# EAGLE schematic DUINOMITE-MEGA_Rev_C (EAGLE 4.16)
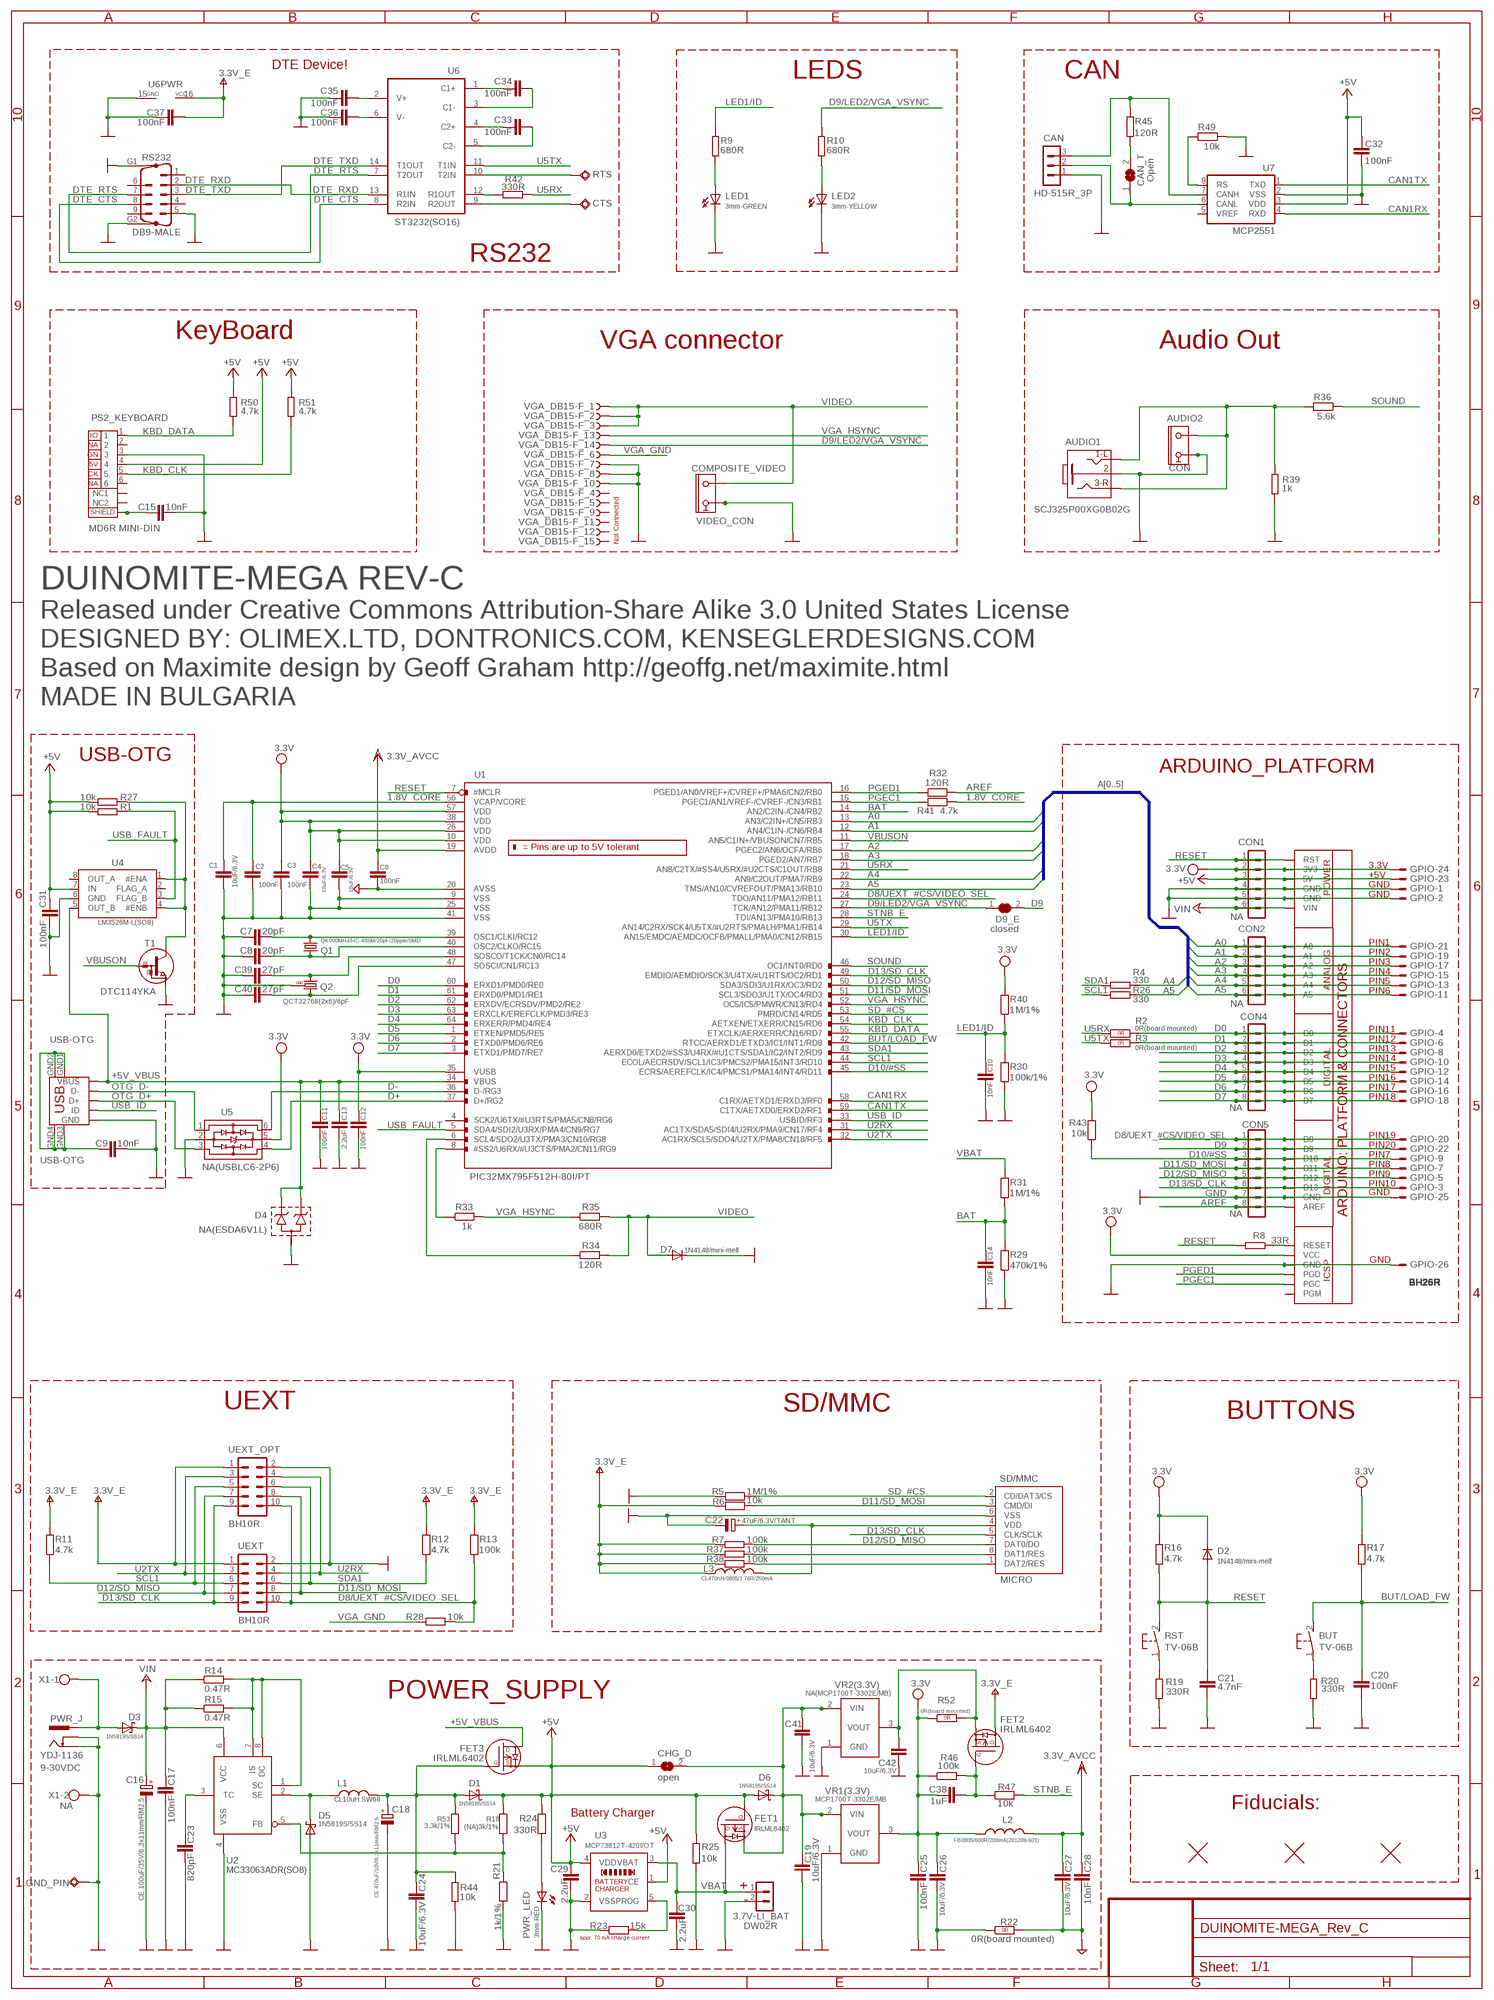
[diagram p0: schematic, sheet 1]

## Parts
3.7V-LI_BAT  DW02R  CON2DW02R  [DW02R]
AUDIO1  SCJ325P00XG0B02G  JACK-3PIN1  [AUDIO_JACK_3.5MM_DECREASED_PAD]
AUDIO2  CON  VIDEO_CINCH  [VIDEO_CINCH]
BUT  TV-06B  31-XX  [B3F-31XX]
C1  10uF/6.3V  C-EUC0805_5MIL_DWS  [C0805_5MIL_DWS]
C2  100nF  C-EUC0603_DWS  [C0603_DWS]
C3  100nF  C-EUC0603_DWS  [C0603_DWS]
C4  10uF/6.3V  C-EUC0603_DWS  [C0603_DWS]
C5  10uF/6.3V  C-EUC0603_DWS  [C0603_DWS]
C6  100nF  C-EUC0603_DWS  [C0603_DWS]
C7  20pF  C-EUC0603_DWS  [C0603_DWS]
C8  20pF  C-EUC0603_DWS  [C0603_DWS]
C9  10nF  C-EUC0603_DWS  [C0603_DWS]
C10  10nF  C-EUC0603_DWS  [C0603_DWS]
C11  100nF  C-EUC0603_DWS  [C0603_DWS]
C12  100nF  C-EUC0603_DWS  [C0603_DWS]
C13  2.2uF  C-EUC0603_DWS  [C0603_DWS]
C14  10nF  C-EUC0603_DWS  [C0603_DWS]
C15  10nF  C-EUC0603_DWS  [C0603_DWS]
C16  CE 100uF/35V/6.3x11mm/RM2.5  CPOL-EUE2.5-6.3  [E2,5-6,3]
C17  100nF  C-EUC0603_DWS  [C0603_DWS]
C18  CE 470uF/10V/6.3x11mm/RM2.5  CPOL-EUE2.5-6.3  [E2,5-6,3]
C19  10uF/6.3V  C-EUC0603_DWS  [C0603_DWS]
C20  100nF  C-EUC0603_DWS  [C0603_DWS]
C21  4.7nF  C-EUC0603_DWS  [C0603_DWS]
C22  47uF/6.3V/TANT  CPOL-EUCT3528  [CT3528]
C23  820pF  C-EUC0603_DWS  [C0603_DWS]
C24  10uF/6.3V  C-EUC0805_5MIL_DWS  [C0805_5MIL_DWS]
C25  100nF  C-EUC0603_DWS  [C0603_DWS]
C26  10uF/6.3V  C-EUC0805_5MIL_DWS  [C0805_5MIL_DWS]
C27  10uF/6.3V  C-EUC0805_5MIL_DWS  [C0805_5MIL_DWS]
C28  10nF  C-EUC0603_DWS  [C0603_DWS]
C29  2.2uF  C-EUC0603_DWS  [C0603_DWS]
C30  2.2uF  C-EUC0603_DWS  [C0603_DWS]
C31  100nF  C-EUC0603_DWS  [C0603_DWS]
C32  100nF  C-EUC0603_DWS  [C0603_DWS]
C33  100nF  C-EUC0603_DWS  [C0603_DWS]
C34  100nF  C-EUC0603_DWS  [C0603_DWS]
C35  100nF  C-EUC0603_DWS  [C0603_DWS]
C36  100nF  C-EUC0603_DWS  [C0603_DWS]
C37  100nF  C-EUC0603_DWS  [C0603_DWS]
C38  1uF  C-EUC0603_DWS  [C0603_DWS]
C39  27pF  C-EUC0603_DWS  [C0603_DWS]
C40  27pF  C-EUC0603_DWS  [C0603_DWS]
C41  10uF/6.3V  C-EUC0603_DWS_NA  [C0603_DWS_NA]
C42  10uF/6.3V  C-EUC0603_DWS_NA  [C0603_DWS_NA]
CAN  HD-515R_3P  CON3HD-515R_3P  [HD-515R_3P]
CAN_T  Open  SJ  [SJ]
CHG_D  open  SJ  [SJ]
COMPOSITE_VIDEO  VIDEO_CON  VIDEO_CINCH  [VIDEO_CINCH]
CON1  NA  CON6PN1X6  [PN1X6]
CON2  NA  CON6PN1X6  [PN1X6]
CON4  NA  CON8PN1X8  [PN1X8]
CON5  NA  CON8PN1X8  [PN1X8]
CTS  TESTPAD3  [TEST_PAD40/70/SQUARE]
D1  1N5819S/SS14  SCHOTKKY7.62SS2  [MLL-41]
D2  1N4148/mini-melf  DSMD  [MINI-MELF]
D3  1N5819S/SS14  SCHOTKKY7.62SS2  [MLL-41]
D4  NA(ESDA6V1L)  MMBZ5V6ALT1  [SOT-23]
D5  1N5819S/SS14  SCHOTKKY7.62SS2  [MLL-41]
D6  1N5819S/SS14  SCHOTKKY7.62SS2  [MLL-41]
D7  1N4148/mini-melf  DSMD  [MINI-MELF]
D9_E  closed  SJSJ-CLOSE  [SJ-CLOSE]
FET1  IRLML6402  P-MOS+DIODIRLML6402  [SOT23]
FET2  IRLML6402  P-MOS+DIODIRLML6402  [SOT23]
FET3  IRLML6402  P-MOS+DIODIRLML6402  [SOT23]
FID1  FIDUCIAL1X2  [FIDUCIAL-1X2]
FID2  FIDUCIAL1X2  [FIDUCIAL-1X2]
FID3  FIDUCIAL1X2  [FIDUCIAL-1X2]
GND_PIN  TESTPAD3  [TEST_PAD40/70/SQUARE]
GPIO  BH26R  ML26RE  [BH26R]
L1  CL10uH SW68  LSW68  [SW68]
L2  FB0805/600R/200mA(201209-601)  L-USL0805_5MIL_DWS  [L0805_5MIL_DWS]
L3  CL470nH/0805/1.76R/250mA  L-USL0805_5MIL_DWS  [L0805_5MIL_DWS]
LED1  3mm-GREEN  LED3.0MM  [LED-3.0MM]
LED2  3mm-YELLOW  LED3.0MM  [LED-3.0MM]
PS2_KEYBOARD  MD6R MINI-DIN  PS2PS2  [PS2]
PWR_J  YDJ-1136  PWR-JAKPWR_JACK_UNI_MILLING  [PWR_JACK_UNI_MILLING]
PWR_LED  3mm-RED  LED3.0MM  [LED-3.0MM]
Q1  Q8.000MHz/HC-49SM/20pF/20ppm/SMD  HC49/S1  [HC49/SMD2_THIN]
Q2  QCT32768(2x6)/6pF  Q_GND1  [TC26H_3_REPAIR_SMD]
R1  10k  R-EU_R0603_5MIL_DWS  [R0603_5MIL_DWS]
R2  0R(board mounted)  R_0R0R(NA)  [0603_0R]
R3  0R(board mounted)  R_0R0R(NA)  [0603_0R]
R4  330  R-EU_R0603_5MIL_DWS  [R0603_5MIL_DWS]
R5  1M/1%  R-EU_R0603_5MIL_DWS  [R0603_5MIL_DWS]
R6  10k  R-EU_R0603_5MIL_DWS  [R0603_5MIL_DWS]
R7  100k  R-EU_R0603_5MIL_DWS  [R0603_5MIL_DWS]
R8  33R  R-EU_R0603_5MIL_DWS  [R0603_5MIL_DWS]
R9  680R  R-EU_R0603_5MIL_DWS  [R0603_5MIL_DWS]
R10  680R  R-EU_R0603_5MIL_DWS  [R0603_5MIL_DWS]
R11  4.7k  R-EU_R0603_5MIL_DWS  [R0603_5MIL_DWS]
R12  4.7k  R-EU_R0603_5MIL_DWS  [R0603_5MIL_DWS]
R13  100k  R-EU_R0603_5MIL_DWS  [R0603_5MIL_DWS]
R14  0.47R  R-EU_R1206_5MIL_WS  [R1206_5MIL_WS]
R15  0.47R  R-EU_R1206_5MIL_WS  [R1206_5MIL_WS]
R16  4.7k  R-EU_R0603_5MIL_DWS  [R0603_5MIL_DWS]
R17  4.7k  R-EU_R0603_5MIL_DWS  [R0603_5MIL_DWS]
R18  (NA)3k/1%  R-EU_R0603_5MIL_DWS  [R0603_5MIL_DWS]
R19  330R  R-EU_R0603_5MIL_DWS  [R0603_5MIL_DWS]
R20  330R  R-EU_R0603_5MIL_DWS  [R0603_5MIL_DWS]
R21  1k/1%  R-EU_R0603_5MIL_DWS  [R0603_5MIL_DWS]
R22  0R(board mounted)  R_0R0R(NA)  [0603_0R]
R23  15k  R-EU_R0603_5MIL_DWS  [R0603_5MIL_DWS]
R24  330R  R-EU_R0603_5MIL_DWS  [R0603_5MIL_DWS]
R25  10k  R-EU_R0603_5MIL_DWS  [R0603_5MIL_DWS]
R26  330  R-EU_R0603_5MIL_DWS  [R0603_5MIL_DWS]
R27  10k  R-EU_R0603_5MIL_DWS  [R0603_5MIL_DWS]
R28  10k  R-EU_R0603_5MIL_DWS  [R0603_5MIL_DWS]
R29  470k/1%  R-EU_R0603_5MIL_DWS  [R0603_5MIL_DWS]
R30  100k/1%  R-EU_R0603_5MIL_DWS  [R0603_5MIL_DWS]
R31  1M/1%  R-EU_R0603_5MIL_DWS  [R0603_5MIL_DWS]
R32  120R  R-EU_R0603_5MIL_DWS  [R0603_5MIL_DWS]
R33  1k  R-EU_R0603_5MIL_DWS  [R0603_5MIL_DWS]
R34  120R  R-EU_R0603_5MIL_DWS  [R0603_5MIL_DWS]
R35  680R  R-EU_R0603_5MIL_DWS  [R0603_5MIL_DWS]
R36  5.6k  R-EU_R0603_5MIL_DWS  [R0603_5MIL_DWS]
R37  100k  R-EU_R0603_5MIL_DWS  [R0603_5MIL_DWS]
R38  100k  R-EU_R0603_5MIL_DWS  [R0603_5MIL_DWS]
R39  1k  R-EU_R0603_5MIL_DWS  [R0603_5MIL_DWS]
R40  1M/1%  R-EU_R0603_5MIL_DWS  [R0603_5MIL_DWS]
R41  4.7k  R-EU_R0603_5MIL_DWS  [R0603_5MIL_DWS]
R42  330R  R-EU_R0603_5MIL_DWS  [R0603_5MIL_DWS]
R43  10k  R-EU_R0603_5MIL_DWS  [R0603_5MIL_DWS]
R44  10k  R-EU_R0603_5MIL_DWS  [R0603_5MIL_DWS]
R45  120R  R-EU_R1206_5MIL_WS  [R1206_5MIL_WS]
R46  100k  R-EU_R0603_5MIL_DWS  [R0603_5MIL_DWS]
R47  10k  R-EU_R0603_5MIL_DWS  [R0603_5MIL_DWS]
R49  10k  R-EU_R0603_5MIL_DWS  [R0603_5MIL_DWS]
R50  4.7k  R-EU_R0603_5MIL_DWS  [R0603_5MIL_DWS]
R51  4.7k  R-EU_R0603_5MIL_DWS  [R0603_5MIL_DWS]
R52  0R(board mounted)  R_0R0R(NA)  [0603_0R]
R53  3.3k/1%  R-EU_R0603_5MIL_DWS  [R0603_5MIL_DWS]
RS232  DB9-MALE  M09HP_DB9-BMR  [DB9-BMR]
RST  TV-06B  31-XX  [B3F-31XX]
RTS  TESTPAD3  [TEST_PAD40/70/SQUARE]
SD/MMC  MICRO  MICRO_SD/MMC  [TFR-MEM-CON]
T1  DTC114YKA  DIGITAL_TRANSISTORS-NPNDTC114YKA  [SOT-23]
U1  PIC32MX795F512H-80I/PT  PIC32MX795F512HT-80I/PT  [LPTQFP64]
U2  MC33063ADR(SO8)  MC34063A_OFF  [SO-8_TRM]
U3  MCP73812T-420I/OT  MCP7381XSOT-23-5  [SOT-23-5]
U4  LM3526M-L(SO8)  LM3526-L  [SO-8]
U5  NA(USBLC6-2P6)  USBLC6-2  [USBLC6-2P6]
U6  ST3232(SO16)  MAX32321  [SO16-150MIL-THIN_PADS]
U7  MCP2551  [SO-08]
U$1  3x(PN1x8)+1x(PN1x6)+WU06S  PIC_PLATFORM3  [PIC_PLATFORM_MAXMITE_WITHOUT_DIMENSIO_LAYER]
UEXT  BH10R  ML10R  [BH10R]
UEXT_OPT  BH10R  ML10R  [BH10R]
USB-OTG  USB-OTG  MINI_USB9  [USB_MINI_9PIN]
VGA_DB15-F  DB1522  [DB15-F_22MM]
VR1(3.3V)  MCP1700T-3302E/MB  MCP1700-REP1  [SOT89_REP_THERMALOFF]
VR2(3.3V)  NA(MCP1700T-3302E/MB)  MCP1700-REP1  [SOT89_REP_THERMALOFF]
X1  NA  W237-102  [W237-102]

## Nets
1.8V_CORE: C1.1 C2.1 R41.1 U1.56(VCAP/VCORE)
+5V: C29.1 C31.1 C32.1 CHG_D.1 CON1.3 D1.K(C) D6.A FET1.1(G) FET3.2(S) GPIO.23 PS2_KEYBOARD.4 R1.2 R18.1 R24.1 R25.1 R27.2 R50.1 R51.1 U3.1(CE) U3.4(VDD) U4.7(IN) U7.3(VDD) U$1.5V
+5V_VBUS [pwr]: C11.2 C13.1 D4.1 D4.2 FET3.3(D) U1.34(VBUS) U4.5(OUT_B) USB-OTG.VBUS
+24V: C16.+ C17.1 CON1.6 D3.K(C) R14.1 R15.1 U2.6(VCC) U$1.VIN ; supply symbol labelled VIN
A0: CON2.1 GPIO.21 U1.13(AN3/C2IN+/CN5/RB3) U$1.A0
A1: CON2.2 GPIO.19 U1.12(AN4/C1IN-/CN6/RB4) U$1.A1
A2: CON2.3 GPIO.17 U1.17(PGEC2/AN6/OCFA/RB6) U$1.A2
A3: CON2.4 GPIO.15 U1.18(PGED2/AN7/RB7) U$1.A3
A4: CON2.5 GPIO.13 R4.1 U1.22(AN9/C2OUT/PMA7/RB9) U$1.A4
A5: CON2.6 GPIO.11 R26.1 U1.23(TMS/AN10/CVREFOUT/PMA13/RB10) U$1.A5
AGND: C6.2 C27.2 C28.2 R22.2(1.2) U1.20(AVSS)
AREF: CON5.8 R32.1 U$1.AREF
BAT: C14.2 R29.2 R31.1 U1.14(AN2/C2IN-/CN4/RB2)
BUT/LOAD_FW: BUT.2(S) C20.1 R17.2 U1.42(RTCC/AERXD1/ETXD3/IC1/INT1/RD8)
CAN1RX: U1.58(C1RX/AETXD1/ERXD3/RF0) U7.4(RXD)
CAN1TX: U1.59(C1TX/AETXD0/ERXD2/RF1) U7.1(TXD)
CANH: CAN.3 R45.2 U7.7(CANH)
CANL: CAN.2 CAN_T.1 U7.6(CANL)
D0: CON4.1 GPIO.4 R2.2(1.2) U1.60(ERXD1/PMD0/RE0) U$1.D0
D1: CON4.2 GPIO.6 R3.2(1.2) U1.61(ERXD0/PMD1/RE1) U$1.D1
D2: CON4.3 GPIO.8 U1.62(ERXDV/ECRSDV/PMD2/RE2) U$1.D2
D3: CON4.4 GPIO.10 U1.63(ERXCLK/EREFCLK/PMD3/RE3) U$1.D3
D4: CON4.5 GPIO.12 U1.64(ERXERR/PMD4/RE4) U$1.D4
D5: CON4.6 GPIO.14 U1.1(ETXEN/PMD5/RE5) U$1.D5
D6: CON4.7 GPIO.16 U1.2(ETXD0/PMD6/RE6) U$1.D6
D7: CON4.8 GPIO.18 U1.3(ETXD1/PMD7/RE7) U$1.D7
D8/UEXT_#CS/VIDEO_SEL: CON5.1 GPIO.20 R13.1 R28.2 U1.24(TDO/AN11/PMA12/RB11) U$1.D8 UEXT.10 UEXT_OPT.10
D9: CON5.2 D9_E.2 GPIO.22 U$1.D9
D9/LED2/VGA_VSYNC: D9_E.1 R10.2 U1.27(TCK/AN12/PMA11/RB12) VGA_DB15-F.14
D10/#SS: CON5.3 GPIO.9 R43.1 U1.45(ECRS/AEREFCLK/IC4/PMCS1/PMA14/INT4/RD11) U$1.D10
D11/SD_MOSI: CON5.4 GPIO.7 R6.1 SD/MMC.3(CMD/DI) U1.51(SCL3/SDO3/U1TX/OC4/RD3) U$1.D11 UEXT.8 UEXT_OPT.8
D12/SD_MISO: CON5.5 GPIO.5 R7.1 SD/MMC.7(DAT0/DO) U1.50(SDA3/SDI3/U1RX/OC3/RD2) U$1.D12 UEXT.7 UEXT_OPT.7
D13/SD_CLK: CON5.6 GPIO.3 SD/MMC.5(CLK/SCLK) U1.49(EMDIO/AEMDIO/SCK3/U4TX/#U1RTS/OC2/RD1) U$1.D13 UEXT.9 UEXT_OPT.9
D+: U1.37(D+/RG2) U5.4
D-: U1.36(D-/RG3) U5.6
DTE_CTS: RS232.8 U6.8(R2IN)
DTE_RTS: RS232.7 U6.7(T2OUT)
DTE_RXD: RS232.2 U6.13(R1IN)
DTE_TXD: RS232.3 U6.14(T1OUT)
GND [pwr]: 3.7V-LI_BAT.2 AUDIO1.1 AUDIO2.GND1(GND) AUDIO2.GND1A(GND) AUDIO2.GND1B(GND) AUDIO2.GND1C(GND) AUDIO2.GND1D(GND) AUDIO2.GND1E(GND) AUDIO2.GND2(GND) AUDIO2.GND3(GND) AUDIO2.GND3C(GND) AUDIO2.GND3D(GND) AUDIO2.GND3E(GND) AUDIO2.GNG3A(GND) AUDIO2.GNG3B(GND) C1.2 C2.2 C3.2 C4.2 C5.2 C7.1 C8.1 C9.1 C10.1 C11.1 C12.1 C13.2 C14.1 C15.2 C16.- C17.2 C18.- C19.2 C20.2 C21.2 C22.- C23.2 C24.2 C25.2 C26.2 C29.2 C30.2 C31.2 C32.2 C35.2 C36.2 C37.2 C39.1 C40.1 C41.2 C42.2 CAN.1 COMPOSITE_VIDEO.GND1(GND) COMPOSITE_VIDEO.GND1A(GND) COMPOSITE_VIDEO.GND1B(GND) COMPOSITE_VIDEO.GND1C(GND) COMPOSITE_VIDEO.GND1D(GND) COMPOSITE_VIDEO.GND1E(GND) COMPOSITE_VIDEO.GND2(GND) COMPOSITE_VIDEO.GND3(GND) COMPOSITE_VIDEO.GND3C(GND) COMPOSITE_VIDEO.GND3D(GND) COMPOSITE_VIDEO.GND3E(GND) COMPOSITE_VIDEO.GNG3A(GND) COMPOSITE_VIDEO.GNG3B(GND) CON1.4 CON1.5 CON5.7 D4.3 D5.A D7.C(K) GND_PIN.P$1(PP) GPIO.1 GPIO.2 GPIO.25 GPIO.26 LED1.K(C) LED2.K(C) PS2_KEYBOARD.3 PWR_J.- PWR_J.-- PWR_LED.K(C) Q2.GND R5.2 R19.1 R20.1 R21.2 R22.1(1.1) R23.1 R25.2 R29.1 R30.1 R39.2 R44.2 R49.1 RS232.5 RS232.G1 RS232.G2 SD/MMC.6(VSS) T1.2(E) U1.9(VSS) U1.25(VSS) U1.41(VSS) U2.4(VSS) U3.2(VSS) U4.6(GND) U5.2 U6.15(GND) U7.2(VSS) U$1.GND U$1.GND@1(GND) U$1.GND@2(GND) U$1.GND@3(GND) UEXT.2 UEXT_OPT.2 USB-OTG.GND VGA_DB15-F.7 VGA_DB15-F.8 VGA_DB15-F.10 VR1(3.3V).1(GND) VR2(3.3V).1(GND) X1.2
KBD_CLK: PS2_KEYBOARD.5 R51.2 U1.54(AETXEN/ETXERR/CN15/RD6)
KBD_DATA: PS2_KEYBOARD.1 R50.2 U1.55(ETXCLK/AERXERR/CN16/RD7)
LED1/ID: C10.2 R9.2 R30.2 R40.1 U1.30(AN15/EMDC/AEMDC/OCFB/PMALL/PMA0/CN12/RB15)
MCIDAT1: R37.1 SD/MMC.8(DAT1/RES)
MCIDAT2: R38.1 SD/MMC.1(DAT2/RES)
N$1: C18.+ C24.1 D1.A FET3.1(G) L1.2 R44.1 R53.1
N$2: C39.2 Q2.1 U1.48(SOSCO/T1CK/CN0/RC14)
N$3: BUT.1(P) R20.2
N$4: R8.1 U$1.RESET
N$5: LED2.A R10.1
N$6: R27.1 T1.3(C) U4.1(#ENA) U4.4(#ENB)
N$7: C42.1 FET2.2(S) R52.2(1.2) VR2(3.3V).3(VOUT)
N$8: PWR_LED.A R24.2
N$9: RTS.P$1(PP) U6.10(T2IN)
N$10: CTS.P$1(PP) U6.9(R2OUT)
N$11: R19.2 RST.1(P)
N$12: C38.2 FET2.1(G) R46.2 R47.1
N$13: R49.2 U7.8(RS)
N$15: AUDIO1.2 AUDIO1.5 AUDIO2.IO R36.2 R39.1
N$17: C7.2 Q1.2 U1.39(OSC1/CLKI/RC12)
N$18: R34.1 U1.6(SCL4/SDO2/U3TX/PMA3/CN10/RG8)
N$19: C8.2 Q1.1 U1.40(OSC2/CLKO/RC15)
N$22: R23.2 U3.5(PROG)
N$23: LED1.A R9.1
N$24: R33.1 U1.8(#SS2/U6RX/#U3CTS/PMA2/CN11/RG9)
N$28: C40.2 Q2.2 U1.47(SOSCI/CN1/RC13)
N$31: C34.1 U6.3(C1-)
N$33: C23.1 U2.3(TC)
N$34: C19.1 C41.1 CHG_D.2 D6.K(C) FET1.2(S) VR1(3.3V).2(VIN) VR1(3.3V).P$2(VIN1) VR2(3.3V).2(VIN) VR2(3.3V).P$2(VIN1)
N$44: C33.1 U6.5(C2-)
N$45: C34.2 U6.1(C1+)
N$46: C33.2 U6.4(C2+)
N$47: C36.1 U6.6(V-)
N$48: C35.1 U6.2(V+)
N$61: R18.2 R21.1 R53.2 U2.5(FB)
N$64: R14.2 R15.2 U2.1(SC) U2.7(IS) U2.8(DC)
N$67 [pwr]: D5.K(C) L1.1 U2.2(SE)
N$69: R42.2 U6.12(R1OUT)
N$75: CAN_T.2 R45.1
N$86: C15.1 PS2_KEYBOARD.SHIELD1 PS2_KEYBOARD.SHIELD2 PS2_KEYBOARD.SHIELD3
N$116: C22.+ L3.2 SD/MMC.4(VDD)
OTG_D+: U5.3 USB-OTG.D+
OTG_D-: U5.1 USB-OTG.D-
PGEC1: R41.2 U1.15(PGEC1/AN1/VREF-/CVREF-/CN3/RB1) U$1.PGC
PGED1: R32.2 U1.16(PGED1/AN0/VREF+/CVREF+/PMA6/CN2/RB0) U$1.PGD
RESET: C21.1 CON1.1 D2.A R8.2 R16.2 RST.2(S) U1.7(#MCLR) U$1.RST
SCL1: R11.1 R26.2 U1.44(ECOL/AECRSDV/SCL1/IC3/PMCS2/PMA15/INT3/RD10) UEXT.5 UEXT_OPT.5
SD_#CS: R5.1 SD/MMC.2(CD/DAT3/CS) U1.53(PMRD/CN14/RD5)
SDA1: R4.2 R12.1 U1.43(AERXD0/ETXD2/#SS3/U4RX/#U1CTS/SDA1/IC2/INT2/RD9) UEXT.6 UEXT_OPT.6
SOUND: R36.1 U1.46(OC1/INT0/RD0)
STNB_E: R47.2 U1.28(TDI/AN13/PMA10/RB13)
U2RX: U1.31(AC1TX/SDA5/SDI4/U2RX/PMA9/CN17/RF4) UEXT.4 UEXT_OPT.4
U2TX: U1.32(AC1RX/SCL5/SDO4/U2TX/PMA8/CN18/RF5) UEXT.3 UEXT_OPT.3
U5RX: R2.1(1.1) R42.1 U1.21(AN8/C2TX/#SS4/U5RX/#U2CTS/C1OUT/RB8)
U5TX: R3.1(1.1) U1.29(AN14/C2RX/SCK4/U5TX/#U2RTS/PMALH/PMA1/RB14) U6.11(T1IN)
USB_FAULT: R1.1 U1.5(SDA4/SDI2/U3RX/PMA4/CN9/RG7) U4.3(FLAG_B)
USB_ID: U1.33(USBID/RF3) USB-OTG.ID
USB_SHIELD: C9.2 USB-OTG.GND1 USB-OTG.GND2 USB-OTG.GND3 USB-OTG.GND4
V+: C37.1 FET2.3(D) L3.1 R6.2 R7.2 R11.2 R12.2 R13.2 R37.2 R38.2 U6.16(VCC) UEXT.1 UEXT_OPT.1 ; supply symbol labelled 3.3V_E
VBAT: 3.7V-LI_BAT.1 C30.1 FET1.3(D) R31.2 U3.3(VBAT)
VBUSON: T1.1(B) U1.11(AN5/C1IN+/VBUSON/CN7/RB5)
VCC: C3.1 C4.1 C5.1 C12.2 C25.1 C26.1 C38.1 CON1.2 D2.C(K) GPIO.24 L2.1 R16.1 R17.1 R40.2 R43.2 R46.1 R52.1(1.1) U1.10(VDD) U1.26(VDD) U1.35(VUSB) U1.38(VDD) U1.57(VDD) U5.5 U$1.3V3 U$1.VCC VR1(3.3V).3(VOUT) ; supply symbol labelled 3.3V
VDD: C6.1 C27.1 C28.1 L2.2 U1.19(AVDD) ; supply symbol labelled 3.3V_AVCC
VGA_GND [pwr]: R28.1 VGA_DB15-F.6
VGA_HSYNC: R33.2 R35.1 U1.52(OC5/IC5/PMWR/CN13/RD4) VGA_DB15-F.13
VIDEO: COMPOSITE_VIDEO.IO D7.A R34.2 R35.2 VGA_DB15-F.1 VGA_DB15-F.2 VGA_DB15-F.3
VIN: D3.A PWR_J.+ X1.1
Unconnected: PS2_KEYBOARD.2 PS2_KEYBOARD.6 PS2_KEYBOARD.NC1 PS2_KEYBOARD.NC2 RS232.1 RS232.4 RS232.6 RS232.9 U1.4(SCK2/U6TX/#U3RTS/PMA5/CN8/RG6) U4.2(FLAG_A) U4.8(OUT_A) U7.5(VREF) U$1.PGM VGA_DB15-F.4 VGA_DB15-F.5 VGA_DB15-F.9 VGA_DB15-F.11 VGA_DB15-F.12 VGA_DB15-F.15

## Buses
A[0..5]

## Notes on the sheet
- DTE Device!
- LEDS | CAN
- RS232
- KeyBoard
- VGA connector | Audio Out
- Not Connected
- DUINOMITE-MEGA REV-C
- Released under Creative Commons Attribution-Share Alike 3.0 United States License
- DESIGNED BY: OLIMEX.LTD, DONTRONICS.COM, KENSEGLERDESIGNS.COM
- Based on Maximite design by Geoff Graham http://geoffg.net/maximite.html
- MADE IN BULGARIA
- USB-OTG
- ARDUINO_PLATFORM
- 3.3V
- +5V
- GND
- GND
- PIN1
- PIN2
- PIN3
- PIN4
- PIN5
- PIN6
- PIN11
- PIN12
- PIN13
- PIN14
- PIN15
- PIN16
- PIN17
- PIN18
- PIN19
- PIN20
- PIN7
- PIN8
- PIN9
- PIN10
- GND
- GND
- UEXT | SD/MMC
- BUTTONS
- POWER_SUPPLY
- 9-30VDC
- Fiducials:
- Battery Charger
- +
- -
- appr. 70 mA charge current

## Power pins joined to a net without a drawn wire
GND: VGA_DB15-F.GND1 VGA_DB15-F.GND2

## Library data of the parts
3.7V-LI_BAT = Penko:CON2
AUDIO1 = gogo:JACK-3PIN
AUDIO2 COMPOSITE_VIDEO = OLIMEX_CONNECTORS:VIDEO_CINCH
BUT RST = switch-omron:31-XX: OMRON SWITCH
C1-C15 C17 C19-C21 C23-C42 = rcl:C-EU: CAPACITOR, European symbol
C16 C18 C22 = rcl:CPOL-EU: POLARIZED CAPACITOR, European symbol
CAN = Penko:CON3
CAN_T CHG_D D9_E = jumper:SJ: SMD solder JUMPER
CON1 CON2 = Penko:CON6: CONNECTORS - 6 PINS
CON4 CON5 = Penko:CON8
CTS GND_PIN RTS = gogo:TESTPAD: drill 40mils, diameter 70mils
D1 D3 D5 D6 = gogo:SCHOTKKY7.62SS
D2 D7 = DOUBLE-SIDE:D: DIODES
D4 = OLIMEX_DISCRET:MMBZ5V6ALT1
FET1-FET3 = Penko:P-MOS+DIOD
FID1-FID3 = SparkFunEagle-6-6-07:FIDUCIAL: Fiducial Alignment Points Various fiducial points for machine vision alignment.
GPIO = con-harting-ml:ML26?E: HARTING
L1 = DOUBLE-SIDE:L
L2 L3 = rcl:L-US: INDUCTOR, American symbol
LED1 LED2 PWR_LED = DOUBLE-SIDE:LED
PS2_KEYBOARD = OLIMEX_CONNECTORS:PS2
PWR_J = gogo:PWR-JAK
Q1 = crystal:HC49/S: CRYSTAL
Q2 = crystal:Q_GND
R1 R4-R21 R23-R47 R49-R51 R53 = rcl:R-EU_: RESISTOR, European symbol
R2 R3 R22 R52 = OLIMEX_DISCRET:R_0R
RS232 = con-subd:M09HP: SUB-D
SD/MMC = OLIMEX_CONNECTORS:MICRO_SD/MMC
T1 = OLIMEX_DISCRET:DIGITAL_TRANSISTORS-NPN: DTC114YKA Digital Transistor - NPN
U1 = OLIMEX_IC:PIC32MX795F512H
U2 = MPLAB_ICD2:MC34063A
U3 = OLIMEX_DISCRET:MCP7381X
U4 = OLIMEX_IC:LM3526-L: LM3526 Dual Port USB Power Switch and Over-Current Protection Features: -> Compatible with USB1.1 and USB2.0; -> 1 ms fault flag delay filters Hot-Plug events; -> Smooth turn-on eliminates in-rush induced voltage drop; -> UL recognized component: REF#205202; -> 1A nominal shortcircuit output current protects PC power supplies; -> Thermal shutdown protects device in direct short condition; -> 500mA minimum continuous load current; -> Small SO-8 package minimizes board space; -> 2.7V to 5.5V input voltage range; -> 140mOhm Max.switch resistance; -> 1 µA Max. standby current; -> 200µA Max. operating current; -> Under-voltage lockout(UVLO);
U5 = OLIMEX_IC:USBLC6-2
U6 = gogo:MAX3232
U7 = arm:MCP2551
U$1 = OLIMEX_CASES:PIC_PLATFORM
UEXT UEXT_OPT = con-harting-ml:ML10: HARTING
USB-OTG = OLIMEX_CONNECTORS:MINI_USB9
VGA_DB15-F = OLIMEX_CONNECTORS:DB15
VR1(3.3V) VR2(3.3V) = OLIMEX_DISCRET:MCP1700-REP
X1 = con-wago-500:W237-102: WAGO SCREW CLAMP

## Net classes
1 pwr: width 0.508 mm, drill 0.241 mm